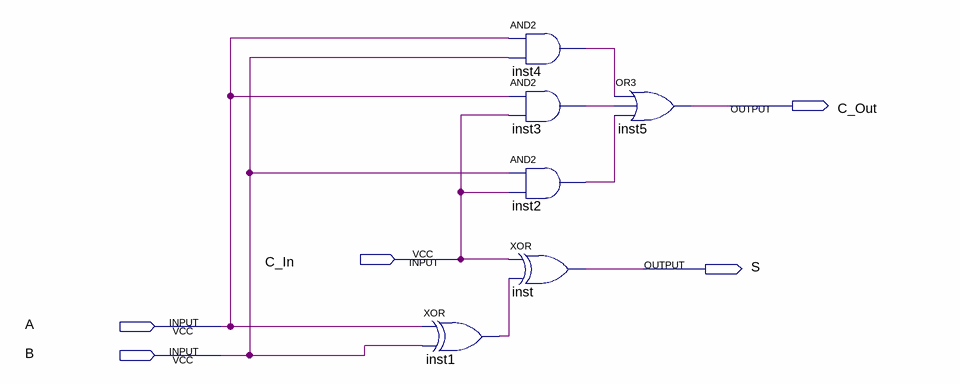
[diagram p0: schematic sheet]
// Quartus schematic LookAheadCarryFullAdder.bdf as structural Verilog: 6 symbols, 5 pins
module LookAheadCarryFullAdder (
  input  C_In,
  input  A,
  input  B,
  output C_Out,
  output S
);

  wire inst1_out, inst2_out, inst3_out, inst4_out;

  xor inst1 (inst1_out, A, B);
  and inst4 (inst4_out, A, B);
  and inst3 (inst3_out, A, C_In);
  and inst2 (inst2_out, B, C_In);
  xor inst (S, C_In, inst1_out);
  or inst5 (C_Out, inst4_out, inst3_out, inst2_out);
endmodule
